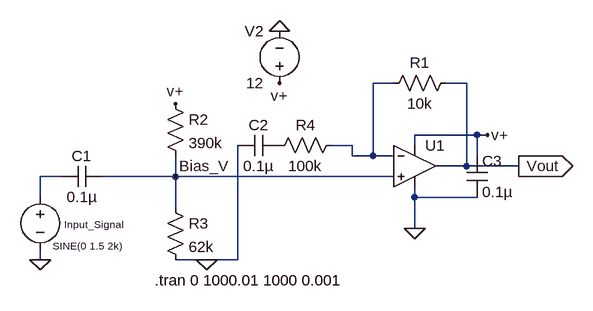
[diagram p0: schematic levelshifter.asc]
levelshifter.asc, the LTspice schematic file:
Version 4.1
SHEET 1 880 680
WIRE 448 0 416 0
WIRE 560 0 528 0
WIRE 576 80 480 80
WIRE 592 80 576 80
WIRE 384 96 352 96
WIRE 480 96 480 80
WIRE 384 112 384 96
WIRE 416 112 416 0
WIRE 416 112 384 112
WIRE 448 112 416 112
WIRE 576 112 576 80
WIRE 560 128 560 0
WIRE 560 128 512 128
WIRE 640 128 560 128
WIRE -64 144 -96 144
WIRE 112 144 112 112
WIRE 112 144 0 144
WIRE 448 144 112 144
WIRE -96 176 -96 144
WIRE 480 176 480 160
WIRE 576 176 480 176
WIRE 112 192 112 144
WIRE 480 224 480 176
WIRE -96 272 -96 256
WIRE 160 272 112 272
WIRE 208 272 208 96
WIRE 208 272 160 272
FLAG -96 272 0
FLAG 640 128 Vout
IOPIN 640 128 Out
FLAG 272 -80 0
FLAG 272 0 v+
FLAG 592 80 v+
FLAG 112 32 v+
FLAG 160 272 0
FLAG 112 144 Bias_V
FLAG 480 224 0
SYMBOL voltage -96 160 R0
WINDOW 0 37 58 Left 1
WINDOW 3 19 91 Left 1
WINDOW 123 24 124 Left 1
WINDOW 39 0 0 Left 0
SYMATTR InstName Input_Signal
SYMATTR Value SINE(0 1.5 2k)
SYMBOL voltage 272 16 R180
WINDOW 0 24 96 Left 2
WINDOW 3 24 16 Left 2
WINDOW 123 0 0 Left 0
WINDOW 39 0 0 Left 0
SYMATTR InstName V2
SYMATTR Value 12
SYMBOL res 544 -16 R90
WINDOW 0 0 56 VBottom 2
WINDOW 3 32 56 VTop 2
SYMATTR InstName R1
SYMATTR Value 10k
SYMBOL res 368 80 R90
WINDOW 0 0 56 VBottom 2
WINDOW 3 32 56 VTop 2
SYMATTR InstName R4
SYMATTR Value 100k
SYMBOL cap 0 128 R90
WINDOW 0 0 32 VBottom 2
WINDOW 3 32 32 VTop 2
SYMATTR InstName C1
SYMATTR Value 0.1µ
SYMBOL res 96 16 R0
SYMATTR InstName R2
SYMATTR Value 390k
SYMBOL res 96 176 R0
SYMATTR InstName R3
SYMATTR Value 62k
SYMBOL cap 272 80 R90
WINDOW 0 0 32 VBottom 2
WINDOW 3 32 32 VTop 2
SYMATTR InstName C2
SYMATTR Value 0.1µ
SYMBOL OpAmps\\UniversalOpAmp2 480 128 R0
SYMATTR InstName U1
SYMATTR Value2 Avol=1Meg GBW=2.2Meg Slew=2Meg
SYMATTR SpiceLine Ilimit=1 Rail=0 Vos=0
SYMBOL cap 560 112 R0
SYMATTR InstName C3
SYMATTR Value 0.1µ
TEXT 80 304 Left 2 !.tran 0 1000.01 1000 0.001

The netlist it stands for:
* levelshifter.asc
V§Input_Signal N002 0 SINE(0 1.5 2k)
V2 v+ 0 12
R1 Vout N001 10k
R4 N001 P001 100k
C1 Bias_V N002 0.1µ
R2 v+ Bias_V 390k
R3 Bias_V 0 62k
C2 P001 0 0.1µ
X§U1 Bias_V N001 v+ 0 Vout level2 Avol=1Meg GBW=2.2Meg Slew=2Meg Ilimit=1 Rail=0 Vos=0 En=0 Enk=0 In=0 Ink=0 Rin=500Meg  ; pins In+ In- V+ V- OUT
C3 v+ 0 0.1µ
.tran 0 1000.01 1000 0.001
.lib UniversalOpAmp2.lib
.backanno
.end